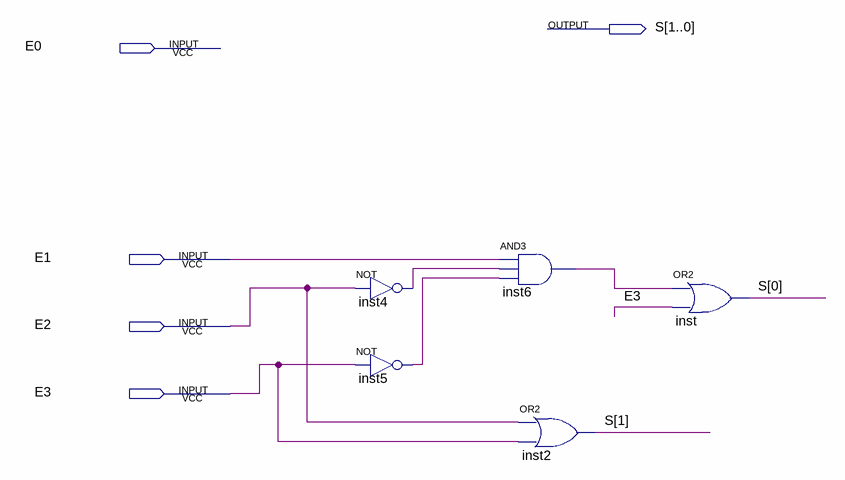
[diagram p0: schematic sheet]
// Quartus schematic seleciona_estado.bdf as structural Verilog: 5 symbols, 5 pins
module seleciona_estado (
  input  E0,
  input  E1,
  input  E2,
  input  E3,
  output [1:0] S
);

  wire inst4_out, inst5_out, inst6_out;

  not inst4 (inst4_out, E2);
  not inst5 (inst5_out, E3);
  and inst6 (inst6_out, E1, inst4_out, inst5_out);
  or inst2 (S[1], E2, E3);
  or inst (S[0], inst6_out, E3);
endmodule
